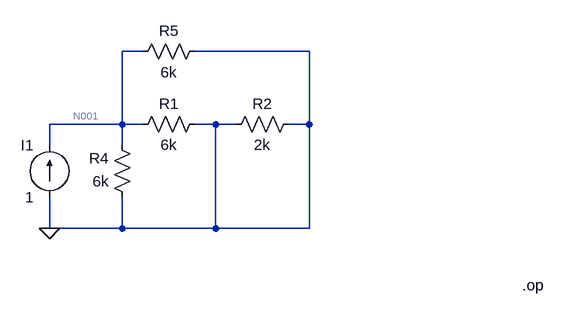
[diagram p0: schematic Lab03_02e.asc]
Lab03_02e.asc, the LTspice schematic file:
Version 4
SHEET 1 880 680
WIRE 208 -80 176 -80
WIRE 464 -80 288 -80
WIRE 176 32 176 -80
WIRE 176 32 64 32
WIRE 208 32 176 32
WIRE 320 32 288 32
WIRE 352 32 320 32
WIRE 464 32 464 -80
WIRE 464 32 432 32
WIRE 64 64 64 32
WIRE 176 64 176 32
WIRE 64 192 64 144
WIRE 176 192 176 144
WIRE 176 192 64 192
WIRE 320 192 320 32
WIRE 320 192 176 192
WIRE 464 192 464 32
WIRE 464 192 320 192
FLAG 64 192 0
DATAFLAG 64 32 ""
SYMBOL current 64 144 R180
WINDOW 0 24 80 Left 2
WINDOW 3 24 0 Left 2
SYMATTR InstName I1
SYMATTR Value 1
SYMBOL res 304 16 R90
WINDOW 0 0 56 VBottom 2
WINDOW 3 32 56 VTop 2
SYMATTR InstName R1
SYMATTR Value 6k
SYMBOL res 448 16 R90
WINDOW 0 0 56 VBottom 2
WINDOW 3 32 56 VTop 2
SYMATTR InstName R2
SYMATTR Value 2k
SYMBOL res 192 160 R180
WINDOW 0 36 76 Left 2
WINDOW 3 36 40 Left 2
SYMATTR InstName R4
SYMATTR Value 6k
SYMBOL res 192 -64 R270
WINDOW 0 32 56 VTop 2
WINDOW 3 0 56 VBottom 2
SYMATTR InstName R5
SYMATTR Value 6k
TEXT 792 280 Left 2 !.op

The netlist it stands for:
* Lab03_02e.asc
I1 0 N001 1
R1 0 N001 6k
R2 0 0 2k
R4 0 N001 6k
R5 N001 0 6k
.op
.backanno
.end

* Results of the author's LTspice run, read from the files saved beside the schematic
* Operating Point:
*   V(n001) = 2 kV
*   I(I1) = 1 A
*   I(R1) = -333.3 mA
*   I(R4) = -333.3 mA
*   I(R5) = 333.3 mA